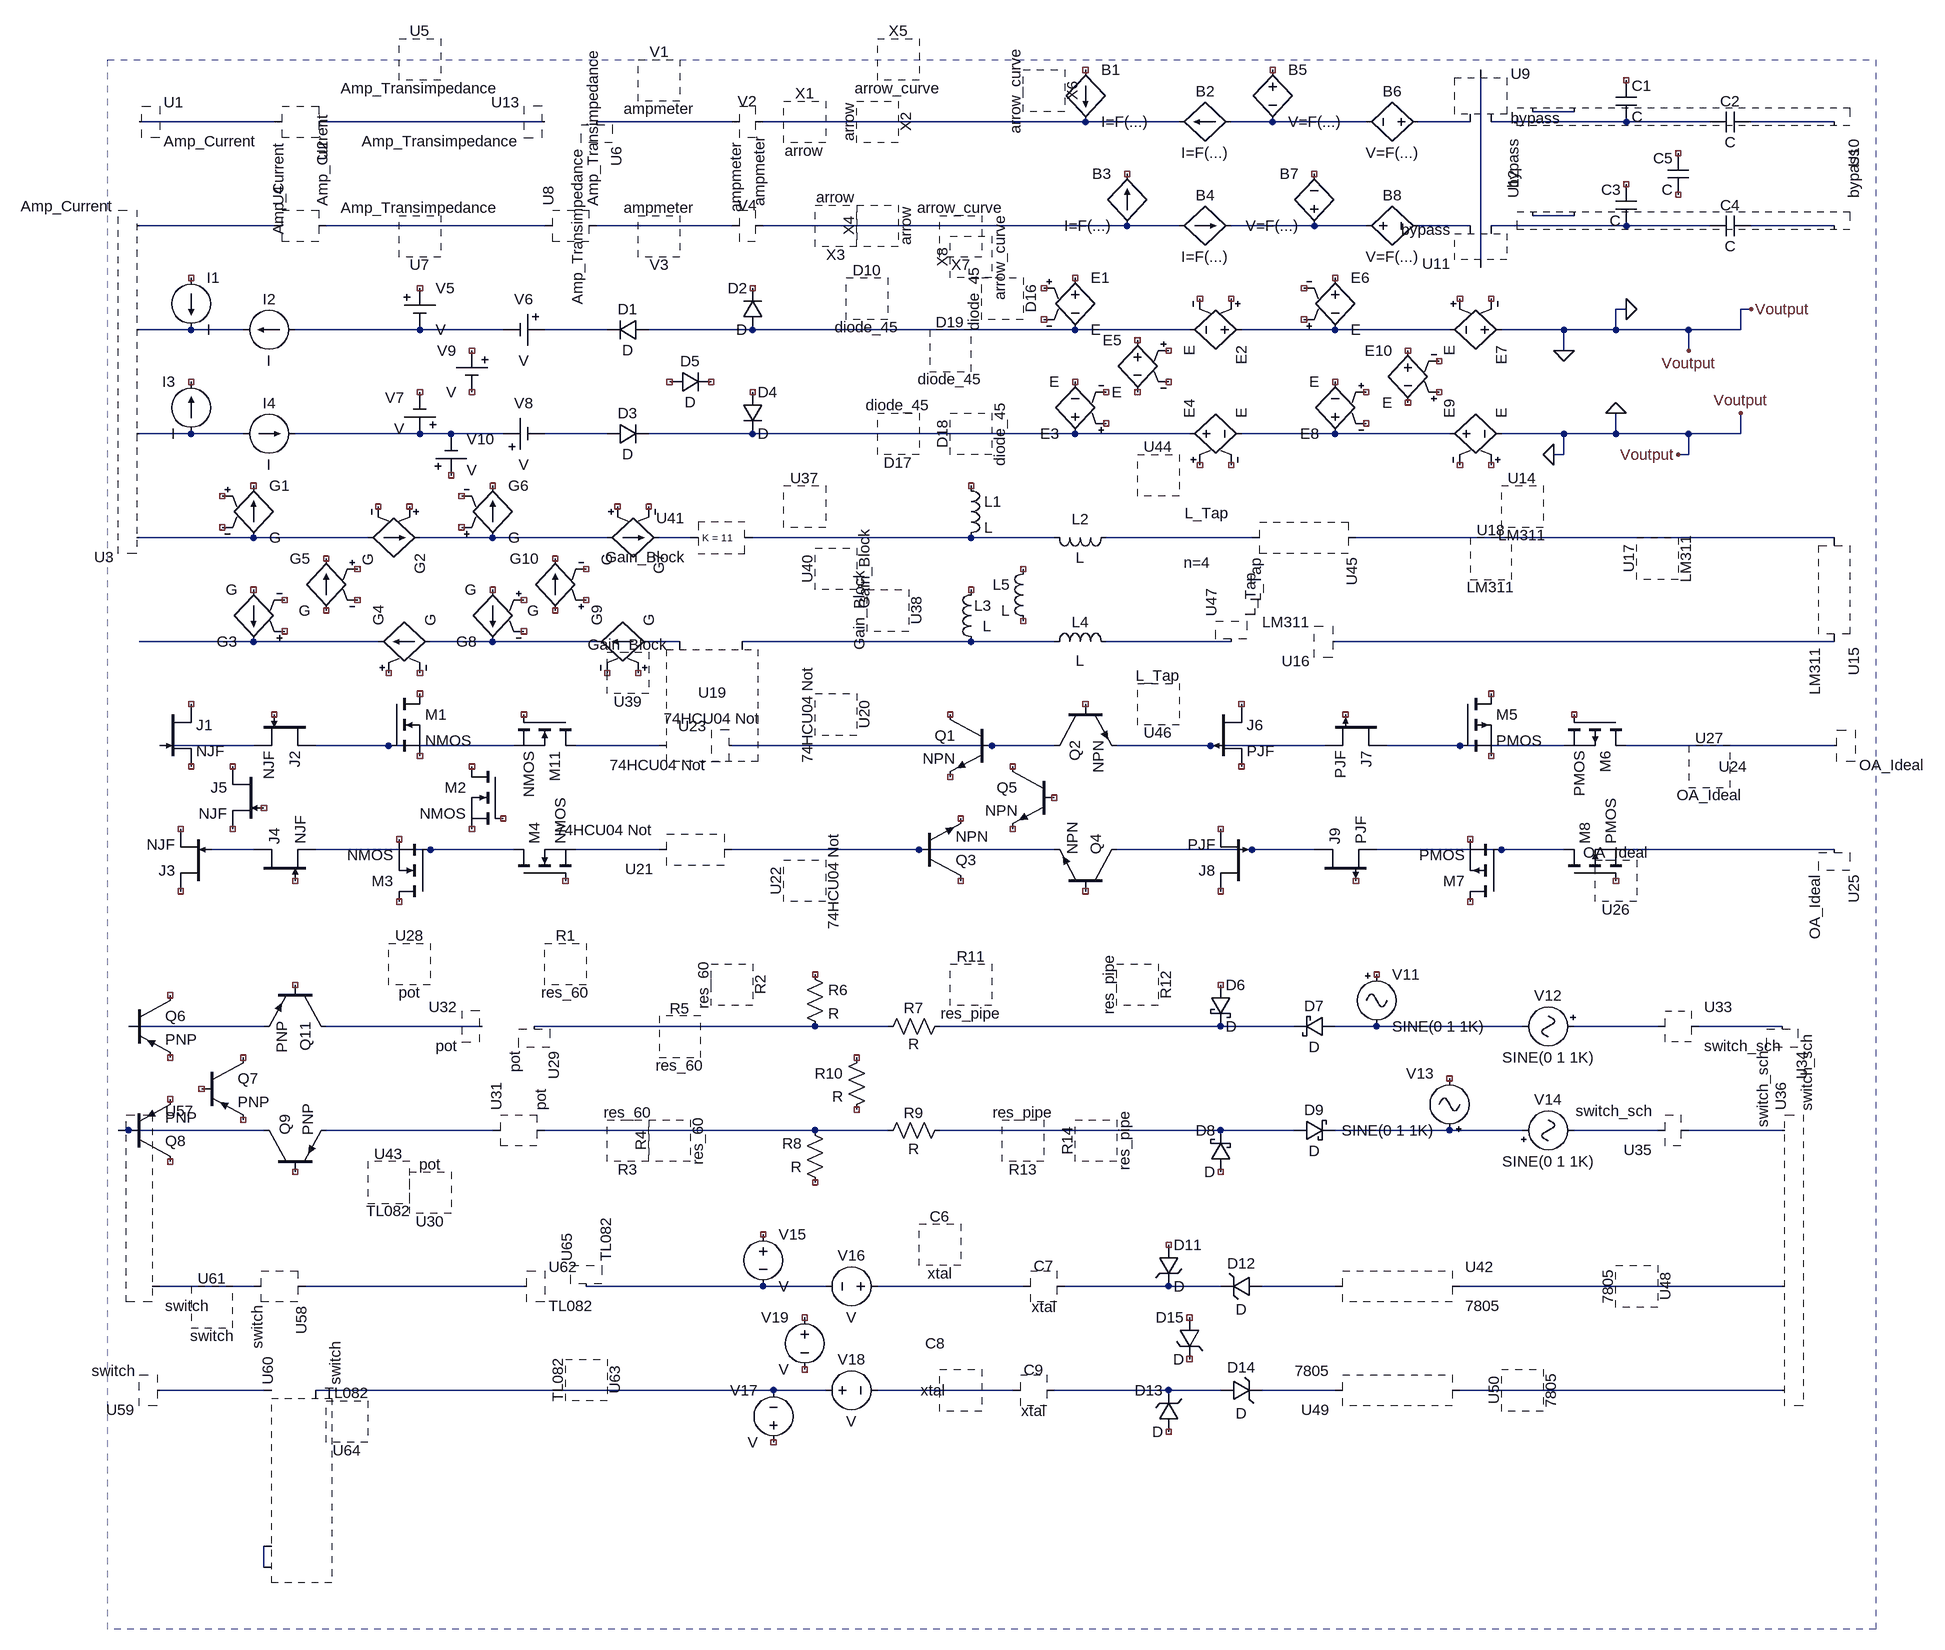
[diagram p0: schematic catalogo.asc]
catalogo.asc, the LTspice schematic file:
Version 4.1
SHEET 1 3172 3000
WIRE 2256 80 2192 80
WIRE 128 96 48 96
WIRE 256 96 128 96
WIRE 480 96 336 96
WIRE 672 96 480 96
WIRE 848 96 752 96
WIRE 960 96 848 96
WIRE 1504 96 1008 96
WIRE 1648 96 1504 96
WIRE 1792 96 1728 96
WIRE 1936 96 1792 96
WIRE 2096 96 2016 96
WIRE 2224 96 2128 96
WIRE 2336 96 2224 96
WIRE 2464 96 2336 96
WIRE 2656 96 2528 96
WIRE 2256 240 2192 240
WIRE 128 256 48 256
WIRE 256 256 128 256
WIRE 480 256 336 256
WIRE 672 256 480 256
WIRE 848 256 752 256
WIRE 960 256 848 256
WIRE 1568 256 1008 256
WIRE 1648 256 1568 256
WIRE 1856 256 1728 256
WIRE 1936 256 1856 256
WIRE 2096 256 2016 256
WIRE 2224 256 2128 256
WIRE 2336 256 2224 256
WIRE 2464 256 2336 256
WIRE 2656 256 2528 256
WIRE 2112 320 2112 16
WIRE 2336 384 2320 384
WIRE 2528 384 2512 384
WIRE 128 416 48 416
WIRE 208 416 128 416
WIRE 480 416 288 416
WIRE 608 416 480 416
WIRE 768 416 672 416
WIRE 992 416 832 416
WIRE 1168 416 992 416
WIRE 1376 416 1168 416
WIRE 1488 416 1376 416
WIRE 1664 416 1488 416
WIRE 1888 416 1744 416
WIRE 2064 416 1888 416
WIRE 2240 416 2144 416
WIRE 2320 416 2320 384
WIRE 2320 416 2240 416
WIRE 2432 416 2320 416
WIRE 2512 416 2512 384
WIRE 2512 416 2432 416
WIRE 2240 448 2240 416
WIRE 2432 448 2432 416
WIRE 128 576 48 576
WIRE 208 576 128 576
WIRE 480 576 288 576
WIRE 528 576 480 576
WIRE 608 576 528 576
WIRE 768 576 672 576
WIRE 992 576 832 576
WIRE 1168 576 992 576
WIRE 1376 576 1168 576
WIRE 1488 576 1376 576
WIRE 1664 576 1488 576
WIRE 1888 576 1744 576
WIRE 2064 576 1888 576
WIRE 2240 576 2144 576
WIRE 2320 576 2320 544
WIRE 2320 576 2240 576
WIRE 2432 576 2320 576
WIRE 2512 576 2512 544
WIRE 2512 576 2432 576
WIRE 2240 608 2240 576
WIRE 2240 608 2224 608
WIRE 2432 608 2432 576
WIRE 2432 608 2416 608
WIRE 224 736 48 736
WIRE 400 736 224 736
WIRE 592 736 480 736
WIRE 768 736 592 736
WIRE 896 736 848 736
WIRE 1328 736 992 736
WIRE 1456 736 1328 736
WIRE 1600 736 1536 736
WIRE 1760 736 1600 736
WIRE 2096 736 1920 736
WIRE 2656 736 2096 736
WIRE 224 896 48 896
WIRE 416 896 224 896
WIRE 592 896 496 896
WIRE 752 896 592 896
WIRE 880 896 832 896
WIRE 1328 896 976 896
WIRE 1456 896 1328 896
WIRE 1632 896 1536 896
WIRE 1728 896 1632 896
WIRE 1968 896 1888 896
WIRE 2656 896 1968 896
WIRE 224 1056 80 1056
WIRE 432 1056 320 1056
WIRE 624 1056 432 1056
WIRE 848 1056 720 1056
WIRE 1360 1056 960 1056
WIRE 1456 1056 1360 1056
WIRE 1696 1056 1552 1056
WIRE 1872 1056 1696 1056
WIRE 2080 1056 1968 1056
WIRE 2240 1056 2080 1056
WIRE 2512 1056 2336 1056
WIRE 2560 1056 2512 1056
WIRE 2656 1056 2560 1056
WIRE 224 1216 160 1216
WIRE 496 1216 320 1216
WIRE 624 1216 496 1216
WIRE 848 1216 720 1216
WIRE 1248 1216 960 1216
WIRE 1456 1216 1248 1216
WIRE 1760 1216 1552 1216
WIRE 1856 1216 1760 1216
WIRE 2144 1216 1952 1216
WIRE 2240 1216 2144 1216
WIRE 2400 1216 2336 1216
WIRE 2656 1216 2400 1216
WIRE 240 1488 32 1488
WIRE 480 1488 336 1488
WIRE 576 1488 480 1488
WIRE 768 1488 656 1488
WIRE 864 1488 768 1488
WIRE 1088 1488 864 1488
WIRE 1200 1488 1088 1488
WIRE 1344 1488 1280 1488
WIRE 1568 1488 1344 1488
WIRE 1712 1488 1568 1488
WIRE 1824 1488 1712 1488
WIRE 1952 1488 1888 1488
WIRE 2176 1488 1952 1488
WIRE 2384 1488 2256 1488
WIRE 2576 1488 2448 1488
WIRE 32 1648 16 1648
WIRE 240 1648 32 1648
WIRE 480 1648 336 1648
WIRE 592 1648 480 1648
WIRE 784 1648 672 1648
WIRE 880 1648 784 1648
WIRE 1088 1648 880 1648
WIRE 1200 1648 1088 1648
WIRE 1344 1648 1280 1648
WIRE 1584 1648 1344 1648
WIRE 1712 1648 1584 1648
WIRE 1824 1648 1712 1648
WIRE 2064 1648 1888 1648
WIRE 2176 1648 2064 1648
WIRE 2368 1648 2256 1648
WIRE 2384 1648 2368 1648
WIRE 2576 1648 2432 1648
WIRE 224 1888 80 1888
WIRE 560 1888 304 1888
WIRE 640 1888 560 1888
WIRE 1008 1888 736 1888
WIRE 1104 1888 1008 1888
WIRE 1296 1888 1184 1888
WIRE 1408 1888 1296 1888
WIRE 1632 1888 1472 1888
WIRE 1712 1888 1632 1888
WIRE 1888 1888 1776 1888
WIRE 2288 1888 2080 1888
WIRE 2576 1888 2288 1888
WIRE 240 2048 80 2048
WIRE 448 2048 320 2048
WIRE 1024 2048 448 2048
WIRE 1104 2048 1024 2048
WIRE 1296 2048 1184 2048
WIRE 1392 2048 1296 2048
WIRE 1632 2048 1456 2048
WIRE 1712 2048 1632 2048
WIRE 1888 2048 1776 2048
WIRE 2240 2048 2080 2048
WIRE 2576 2048 2240 2048
WIRE 240 2320 240 2288
FLAG 2240 448 0
FLAG 2336 384 0
FLAG 2224 608 0
FLAG 2320 544 0
FLAG 2432 448 Voutput
FLAG 2528 384 Voutput
FLAG 2416 608 Voutput
FLAG 2512 544 Voutput
SYMBOL TCLib\\Amp_Current 128 0 R0
SYMATTR InstName U1
SYMBOL TCLib\\Amp_Current 352 96 R90
SYMATTR InstName U2
SYMBOL TCLib\\Amp_Current 128 272 R180
SYMATTR InstName U3
SYMBOL TCLib\\Amp_Current 240 256 R270
SYMATTR InstName U4
SYMBOL TCLib\\Amp_Transimpedance 480 0 R0
SYMATTR InstName U5
SYMBOL TCLib\\Amp_Transimpedance 768 96 R90
SYMATTR InstName U6
SYMBOL TCLib\\Amp_Transimpedance 480 272 R180
SYMATTR InstName U7
SYMBOL TCLib\\Amp_Transimpedance 656 256 R270
SYMATTR InstName U8
SYMBOL TCLib\\Special\\ampmeter 848 32 R0
SYMATTR InstName V1
SYMBOL TCLib\\Special\\ampmeter 1024 96 R90
WINDOW 0 -16 40 VBottom 2
SYMATTR InstName V2
SYMBOL TCLib\\Special\\ampmeter 848 272 R180
SYMATTR InstName V3
SYMBOL TCLib\\Special\\ampmeter 944 256 R270
WINDOW 0 16 40 VTop 2
SYMATTR InstName V4
SYMBOL TCLib\\Special\\arrow 1072 96 R0
SYMATTR InstName X1
SYMBOL TCLib\\Special\\arrow 1184 96 R90
SYMATTR InstName X2
SYMBOL TCLib\\Special\\arrow 1120 256 R180
SYMATTR InstName X3
SYMBOL TCLib\\Special\\arrow 1184 256 R270
SYMATTR InstName X4
SYMBOL TCLib\\Special\\arrow_curve 1216 0 R0
SYMATTR InstName X5
SYMBOL TCLib\\Special\\arrow_curve 1440 48 R90
SYMATTR InstName X6
SYMBOL TCLib\\Special\\arrow_curve 1312 272 R180
SYMATTR InstName X7
SYMBOL TCLib\\Special\\arrow_curve 1328 304 R270
SYMATTR InstName X8
SYMBOL bi 1504 16 R0
SYMATTR InstName B1
SYMBOL bi 1728 96 R90
WINDOW 0 -32 40 VBottom 2
WINDOW 3 32 40 VTop 2
SYMATTR InstName B2
SYMBOL bi 1568 256 R180
WINDOW 0 24 80 Left 2
WINDOW 3 24 0 Left 2
SYMATTR InstName B3
SYMBOL bi 1648 256 R270
WINDOW 0 32 40 VTop 2
WINDOW 3 -32 40 VBottom 2
SYMATTR InstName B4
SYMBOL bv 1792 0 R0
SYMATTR InstName B5
SYMBOL bv 2032 96 R90
WINDOW 0 -32 56 VBottom 2
WINDOW 3 32 56 VTop 2
SYMATTR InstName B6
SYMBOL bv 1856 272 R180
WINDOW 0 24 96 Left 2
WINDOW 3 24 16 Left 2
SYMATTR InstName B7
SYMBOL bv 1920 256 R270
WINDOW 0 32 56 VTop 2
WINDOW 3 -32 56 VBottom 2
SYMATTR InstName B8
SYMBOL TCLib\\Special\\bypass 2096 96 R0
SYMATTR InstName U9
SYMBOL TCLib\\Special\\bypass 2224 64 R90
SYMATTR InstName U10
SYMBOL TCLib\\Special\\bypass 2128 256 R180
SYMATTR InstName U11
SYMBOL TCLib\\Special\\bypass 2224 256 R270
SYMATTR InstName U12
SYMBOL current 128 336 R0
SYMATTR InstName I1
SYMBOL current 288 416 R90
WINDOW 0 -32 40 VBottom 2
WINDOW 3 32 40 VTop 2
SYMATTR InstName I2
SYMBOL current 208 576 R270
WINDOW 0 32 40 VTop 2
WINDOW 3 -32 40 VBottom 2
SYMATTR InstName I4
SYMBOL current 128 576 R180
WINDOW 0 24 80 Left 2
WINDOW 3 24 0 Left 2
SYMATTR InstName I3
SYMBOL Misc\\cell 480 352 R0
SYMATTR InstName V5
SYMBOL Misc\\cell 672 416 R90
WINDOW 0 -32 32 VBottom 2
WINDOW 3 32 32 VTop 2
SYMATTR InstName V6
SYMBOL Misc\\cell 480 576 R180
WINDOW 0 24 56 Left 2
WINDOW 3 24 8 Left 2
SYMATTR InstName V7
SYMBOL Misc\\cell 608 576 R270
WINDOW 0 32 32 VTop 2
WINDOW 3 -32 32 VBottom 2
SYMATTR InstName V8
SYMBOL Misc\\cell 560 448 M0
SYMATTR InstName V9
SYMBOL TCLib\\Amp_Transimpedance 608 112 M0
SYMATTR InstName U13
SYMBOL diode 832 400 R90
WINDOW 0 0 32 VBottom 2
WINDOW 3 32 32 VTop 2
SYMATTR InstName D1
SYMBOL diode 1008 416 R180
WINDOW 0 24 64 Left 2
WINDOW 3 24 0 Left 2
SYMATTR InstName D2
SYMBOL diode 768 592 R270
WINDOW 0 32 32 VTop 2
WINDOW 3 0 32 VBottom 2
SYMATTR InstName D3
SYMBOL diode 976 512 R0
SYMATTR InstName D4
SYMBOL diode 864 480 M90
WINDOW 0 0 32 VBottom 2
WINDOW 3 32 32 VTop 2
SYMATTR InstName D5
SYMBOL e 1488 320 R0
SYMATTR InstName E1
SYMBOL e 1760 416 R90
SYMATTR InstName E2
SYMBOL e 1488 592 R180
SYMATTR InstName E3
SYMBOL e 1648 576 R270
SYMATTR InstName E4
SYMBOL e 1584 416 M0
SYMATTR InstName E5
SYMBOL e2 1888 320 R0
SYMATTR InstName E6
SYMBOL e2 2160 416 R90
SYMATTR InstName E7
SYMBOL e2 1888 592 R180
SYMATTR InstName E8
SYMBOL e2 2048 576 R270
SYMATTR InstName E9
SYMBOL e2 2000 432 M0
SYMATTR InstName E10
SYMBOL cap 2320 32 R0
SYMATTR InstName C1
SYMBOL cap 2528 80 R90
WINDOW 0 0 32 VBottom 2
WINDOW 3 32 32 VTop 2
SYMATTR InstName C2
SYMBOL cap 2352 256 R180
WINDOW 0 24 56 Left 2
WINDOW 3 24 8 Left 2
SYMATTR InstName C3
SYMBOL cap 2464 272 R270
WINDOW 0 32 32 VTop 2
WINDOW 3 0 32 VBottom 2
SYMATTR InstName C4
SYMBOL cap 2432 144 M0
SYMATTR InstName C5
SYMBOL g 224 640 R0
SYMATTR InstName G1
SYMBOL g 496 736 R90
SYMATTR InstName G2
SYMBOL g 224 912 R180
SYMATTR InstName G3
SYMBOL g 400 896 R270
SYMATTR InstName G4
SYMBOL g 336 752 M0
SYMATTR InstName G5
SYMBOL g2 592 640 R0
SYMATTR InstName G6
SYMBOL g2 864 736 R90
SYMATTR InstName G7
SYMBOL g2 592 912 R180
SYMATTR InstName G8
SYMBOL g2 736 896 R270
SYMATTR InstName G9
SYMBOL g2 688 752 M0
SYMATTR InstName G10
SYMBOL ind 1312 640 R0
SYMATTR InstName L1
SYMBOL ind 1552 720 R90
WINDOW 3 31 56 VTop 2
WINDOW 0 3 56 VBottom 2
SYMATTR InstName L2
SYMBOL ind 1344 912 R180
WINDOW 3 -2 40 Right 2
WINDOW 0 -2 72 Center 2
SYMATTR InstName L3
SYMBOL ind 1440 912 R270
WINDOW 3 3 56 VBottom 2
WINDOW 0 31 56 VTop 2
SYMATTR InstName L4
SYMBOL ind 1424 768 M0
SYMATTR InstName L5
SYMBOL TCLib\\LM311 2176 688 R0
SYMATTR InstName U14
SYMBOL TCLib\\LM311 2512 864 R90
SYMATTR InstName U15
SYMBOL TCLib\\LM311 1888 944 R180
SYMATTR InstName U16
SYMBOL TCLib\\LM311 2384 768 R270
SYMATTR InstName U17
SYMBOL TCLib\\LM311 2128 768 M0
SYMATTR InstName U18
SYMBOL TCLib\\Special\\74HCU04\ Not 896 992 R0
SYMATTR InstName U19
SYMBOL TCLib\\Special\\74HCU04\ Not 1120 1008 R90
SYMATTR InstName U20
SYMBOL TCLib\\Special\\74HCU04\ Not 912 1280 R180
SYMATTR InstName U21
SYMBOL TCLib\\Special\\74HCU04\ Not 1072 1264 R270
SYMATTR InstName U22
SYMBOL TCLib\\Special\\74HCU04\ Not 1024 1072 M0
SYMATTR InstName U23
SYMBOL npn 1360 1008 M0
SYMATTR InstName Q1
SYMBOL npn 1456 992 M90
SYMATTR InstName Q2
SYMBOL npn 1248 1264 M180
SYMATTR InstName Q3
SYMBOL npn 1552 1280 M270
SYMATTR InstName Q4
SYMBOL npn 1456 1088 M0
SYMATTR InstName Q5
SYMBOL TCLib\\TL082 432 1728 M0
SYMATTR InstName U43
SYMBOL TCLib\\Special\\L_Tap 1616 640 R0
WINDOW 3 41 58 Left 2
WINDOW 123 39 134 Left 2
SYMATTR Value2 n=4
SYMATTR InstName U44
SYMBOL TCLib\\Special\\L_Tap 1936 720 R90
SYMATTR InstName U45
SYMBOL TCLib\\Special\\L_Tap 1616 992 R180
SYMATTR InstName U46
SYMBOL TCLib\\Special\\L_Tap 1712 912 R270
SYMATTR InstName U47
SYMBOL res 1072 1392 R0
SYMATTR InstName R6
SYMBOL res 1296 1472 R90
WINDOW 0 3 56 VBottom 2
WINDOW 3 27 56 VTop 2
SYMATTR InstName R7
SYMBOL res 1104 1744 R180
WINDOW 0 36 76 Left 2
WINDOW 3 36 40 Left 2
SYMATTR InstName R8
SYMBOL res 1184 1664 R270
WINDOW 0 27 56 VTop 2
WINDOW 3 3 56 VBottom 2
SYMATTR InstName R9
SYMBOL res 1168 1520 M0
SYMATTR InstName R10
SYMBOL TCLib\\switch 80 1792 R0
SYMATTR InstName U57
SYMBOL TCLib\\switch 320 1888 R90
SYMATTR InstName U58
SYMBOL TCLib\\switch 80 2144 R180
SYMATTR InstName U59
SYMBOL TCLib\\switch 224 2048 R270
SYMATTR InstName U60
SYMBOL TCLib\\switch 160 1920 M0
SYMATTR InstName U61
SYMBOL TCLib\\TL082 640 1840 R0
SYMATTR InstName U62
SYMBOL TCLib\\TL082 736 2032 R90
SYMATTR InstName U63
SYMBOL TCLib\\TL082 368 2096 R180
SYMATTR InstName U64
SYMBOL TCLib\\TL082 656 1936 R270
SYMATTR InstName U65
SYMBOL voltage 1008 1792 R0
SYMATTR InstName V15
SYMBOL voltage 1200 1888 R90
WINDOW 0 -32 56 VBottom 2
WINDOW 3 32 56 VTop 2
SYMATTR InstName V16
SYMBOL voltage 1024 2144 R180
WINDOW 0 24 96 Left 2
WINDOW 3 24 16 Left 2
SYMATTR InstName V17
SYMBOL voltage 1088 2048 R270
WINDOW 0 32 56 VTop 2
WINDOW 3 -32 56 VBottom 2
SYMATTR InstName V18
SYMBOL voltage 1072 1920 M0
SYMATTR InstName V19
SYMBOL zener 1616 1824 R0
SYMATTR InstName D11
SYMBOL zener 1776 1872 R90
WINDOW 0 -4 32 VBottom 2
WINDOW 3 36 32 VTop 2
SYMATTR InstName D12
SYMBOL zener 1648 2112 R180
WINDOW 0 24 64 Left 2
WINDOW 3 24 0 Left 2
SYMATTR InstName D13
SYMBOL zener 1712 2064 R270
WINDOW 0 36 32 VTop 2
WINDOW 3 -4 32 VBottom 2
SYMATTR InstName D14
SYMBOL zener 1680 1936 M0
SYMATTR InstName D15
SYMBOL njf 80 992 R0
SYMATTR InstName J1
SYMBOL njf 320 1008 R90
SYMATTR InstName J2
SYMBOL njf 160 1280 R180
SYMATTR InstName J3
SYMBOL njf 224 1264 R270
SYMATTR InstName J4
SYMBOL nmos 432 976 R0
SYMATTR InstName M1
SYMBOL nmos 496 1296 R180
SYMATTR InstName M3
SYMBOL nmos 624 1264 R270
SYMATTR InstName M4
SYMBOL pjf 1696 992 R0
SYMATTR InstName J6
SYMBOL pjf 1968 1008 R90
SYMATTR InstName J7
SYMBOL pjf 1760 1280 R180
SYMATTR InstName J8
SYMBOL pjf 1856 1264 R270
SYMATTR InstName J9
SYMBOL pmos 2080 976 R0
SYMATTR InstName M5
SYMBOL pmos 2336 1008 R90
SYMATTR InstName M6
SYMBOL pmos 2144 1296 R180
SYMATTR InstName M7
SYMBOL pmos 2240 1264 R270
SYMATTR InstName M8
SYMBOL TCLib\\OA_Ideal 2592 1008 R0
WINDOW 0 -114 80 Left 2
SYMATTR InstName U24
SYMBOL TCLib\\OA_Ideal 2608 1136 R90
SYMATTR InstName U25
SYMBOL TCLib\\OA_Ideal 2320 1264 R180
SYMATTR InstName U26
SYMBOL TCLib\\OA_Ideal 2464 1088 M0
SYMATTR InstName U27
SYMBOL pnp 32 1440 R0
SYMATTR InstName Q6
SYMBOL pnp 336 1424 R90
SYMATTR InstName Q11
SYMBOL pnp 32 1696 M180
SYMATTR InstName Q8
SYMBOL pnp 240 1712 R270
SYMATTR InstName Q9
SYMBOL pnp 144 1536 R0
SYMATTR InstName Q7
SYMBOL TCLib\\pot 464 1392 R0
SYMATTR InstName U28
SYMBOL TCLib\\pot 672 1472 R90
SYMATTR InstName U29
SYMBOL TCLib\\pot 496 1744 R180
SYMATTR InstName U30
SYMBOL TCLib\\pot 576 1664 R270
SYMATTR InstName U31
SYMBOL TCLib\\pot 544 1520 M0
SYMATTR InstName U32
SYMBOL schottky 1696 1424 R0
SYMATTR InstName D6
SYMBOL schottky 1888 1472 R90
WINDOW 0 0 32 VBottom 2
WINDOW 3 32 32 VTop 2
SYMATTR InstName D7
SYMBOL schottky 1728 1712 R180
WINDOW 0 24 64 Left 2
WINDOW 3 24 0 Left 2
SYMATTR InstName D8
SYMBOL schottky 1824 1664 R270
WINDOW 0 32 32 VTop 2
WINDOW 3 0 32 VBottom 2
SYMATTR InstName D9
SYMBOL TCLib\\Special\\switch_sch 2368 1472 R0
SYMATTR InstName U33
SYMBOL TCLib\\Special\\switch_sch 2592 1408 R90
SYMATTR InstName U34
SYMBOL TCLib\\Special\\switch_sch 2448 1664 R180
SYMATTR InstName U35
SYMBOL TCLib\\Special\\switch_sch 2560 1728 R270
SYMATTR InstName U36
SYMBOL TCLib\\Special\\res_60 704 1392 R0
SYMATTR InstName R1
SYMBOL TCLib\\Special\\res_60 960 1424 R90
SYMATTR InstName R2
SYMBOL TCLib\\Special\\res_60 800 1664 R180
SYMATTR InstName R3
SYMBOL TCLib\\Special\\res_60 864 1664 R270
SYMATTR InstName R4
SYMBOL Misc\\cell 528 640 M180
WINDOW 0 24 56 Left 2
WINDOW 3 24 8 Left 2
SYMATTR InstName V10
SYMBOL njf 240 1088 M0
SYMATTR InstName J5
SYMBOL nmos 608 1088 M0
SYMATTR InstName M2
SYMBOL nmos 720 1008 R90
SYMATTR InstName M11
SYMBOL TCLib\\Special\\res_60 880 1504 M0
SYMATTR InstName R5
SYMBOL TCLib\\Special\\diode_45 1168 368 R0
SYMATTR InstName D10
SYMBOL TCLib\\Special\\diode_45 1376 368 R90
SYMATTR InstName D16
SYMBOL TCLib\\Special\\diode_45 1216 576 R180
SYMATTR InstName D17
SYMBOL TCLib\\Special\\diode_45 1328 576 R270
SYMATTR InstName D18
SYMBOL TCLib\\Special\\diode_45 1296 448 M0
SYMATTR InstName D19
SYMBOL TCLib\\Special\\Gain_Block 1072 688 R0
WINDOW 3 -158 48 Left 1
SYMATTR Value K = 11
SYMATTR InstName U37
SYMBOL TCLib\\Special\\Gain_Block 1200 848 R90
SYMATTR InstName U38
SYMBOL TCLib\\Special\\Gain_Block 800 944 R180
SYMATTR InstName U39
SYMBOL TCLib\\Special\\Gain_Block 1120 784 R270
SYMATTR InstName U40
SYMBOL TCLib\\Special\\Gain_Block 912 768 M0
SYMATTR InstName U41
SYMBOL TCLib\\Special\\res_pipe 1328 1424 R0
SYMATTR InstName R11
SYMBOL TCLib\\Special\\res_pipe 1584 1424 R90
SYMATTR InstName R12
SYMBOL TCLib\\Special\\res_pipe 1408 1664 R180
SYMATTR InstName R13
SYMBOL TCLib\\Special\\res_pipe 1520 1664 R270
SYMATTR InstName R14
SYMBOL Misc\\signal 1952 1392 R0
SYMATTR InstName V11
SYMBOL Misc\\signal 2272 1488 R90
WINDOW 0 -32 56 VBottom 2
WINDOW 3 32 56 VTop 2
SYMATTR InstName V12
SYMBOL Misc\\signal 2064 1664 R180
WINDOW 0 24 104 Left 2
WINDOW 3 24 16 Left 2
SYMATTR InstName V13
SYMBOL Misc\\signal 2160 1648 R270
WINDOW 0 32 56 VTop 2
WINDOW 3 -32 56 VBottom 2
SYMATTR InstName V14
SYMBOL Misc\\xtal 1280 1824 R0
SYMATTR InstName C6
SYMBOL Misc\\xtal 1472 1872 R90
WINDOW 0 0 32 VBottom 2
WINDOW 3 32 32 VTop 2
SYMATTR InstName C7
SYMBOL Misc\\xtal 1312 2048 R180
WINDOW 0 24 72 Left 2
WINDOW 3 24 0 Left 2
SYMATTR InstName C8
SYMBOL Misc\\xtal 1392 2064 R270
WINDOW 0 32 32 VTop 2
WINDOW 3 0 32 VBottom 2
SYMATTR InstName C9
SYMBOL TCLib\\Regulators\\7805 1984 1888 R0
SYMATTR InstName U42
SYMBOL TCLib\\Regulators\\7805 2352 1888 R90
SYMATTR InstName U48
SYMBOL TCLib\\Regulators\\7805 1984 2048 R180
SYMATTR InstName U49
SYMBOL TCLib\\Regulators\\7805 2176 2048 R270
SYMATTR InstName U50
RECTANGLE Normal 2720 2416 0 0 2

The netlist it stands for:
* catalogo.asc
* U1: Amp_Current (symbol TCLib\Amp_Current not available, pin order unknown); nets seen at it: N002
* U2: Amp_Current (symbol TCLib\Amp_Current not available, pin order unknown); nets seen at it: N002, N003
* U3: Amp_Current (symbol TCLib\Amp_Current not available, pin order unknown); nets seen at it: N011, N020, N025, N030
* U4: Amp_Current (symbol TCLib\Amp_Current not available, pin order unknown); nets seen at it: N011, N012
* U5: Amp_Transimpedance (symbol TCLib\Amp_Transimpedance not available, pin order unknown); nets seen at it: 
* U6: Amp_Transimpedance (symbol TCLib\Amp_Transimpedance not available, pin order unknown); nets seen at it: N004
* U7: Amp_Transimpedance (symbol TCLib\Amp_Transimpedance not available, pin order unknown); nets seen at it: 
* U8: Amp_Transimpedance (symbol TCLib\Amp_Transimpedance not available, pin order unknown); nets seen at it: N012, N013
* V1: ampmeter (symbol TCLib\Special\ampmeter not available, pin order unknown); nets seen at it: 
* V2: ampmeter (symbol TCLib\Special\ampmeter not available, pin order unknown); nets seen at it: N004, N005
* V3: ampmeter (symbol TCLib\Special\ampmeter not available, pin order unknown); nets seen at it: 
* V4: ampmeter (symbol TCLib\Special\ampmeter not available, pin order unknown); nets seen at it: N013, N014
* X1: arrow (symbol TCLib\Special\arrow not available, pin order unknown); nets seen at it: 
* X2: arrow (symbol TCLib\Special\arrow not available, pin order unknown); nets seen at it: 
* X3: arrow (symbol TCLib\Special\arrow not available, pin order unknown); nets seen at it: 
* X4: arrow (symbol TCLib\Special\arrow not available, pin order unknown); nets seen at it: 
* X5: arrow_curve (symbol TCLib\Special\arrow_curve not available, pin order unknown); nets seen at it: 
* X6: arrow_curve (symbol TCLib\Special\arrow_curve not available, pin order unknown); nets seen at it: 
* X7: arrow_curve (symbol TCLib\Special\arrow_curve not available, pin order unknown); nets seen at it: 
* X8: arrow_curve (symbol TCLib\Special\arrow_curve not available, pin order unknown); nets seen at it: 
B1 NC_01 N005 I=F(...)
B2 N006 N005 I=F(...)
B3 N014 NC_02 I=F(...)
B4 N014 N015 I=F(...)
B5 NC_03 N006 V=F(...)
B6 N007 N006 V=F(...)
B7 N015 NC_04 V=F(...)
B8 N015 N016 V=F(...)
* U9: bypass (symbol TCLib\Special\bypass not available, pin order unknown); nets seen at it: N007, N008, N019
* U10: bypass (symbol TCLib\Special\bypass not available, pin order unknown); nets seen at it: N001, N009
* U11: bypass (symbol TCLib\Special\bypass not available, pin order unknown); nets seen at it: N016, N017, N019
* U12: bypass (symbol TCLib\Special\bypass not available, pin order unknown); nets seen at it: N010, N018
I1 NC_05 N020 I
I2 N021 N020 I
I4 N025 N026 I
I3 N025 NC_06 I
V5 NC_07 N021 V
V6 N022 N021 V
V7 N026 NC_08 V
V8 N026 N027 V
V9 NC_09 NC_10 V
* U13: Amp_Transimpedance (symbol TCLib\Amp_Transimpedance not available, pin order unknown); nets seen at it: N003
D1 N023 N022 D
D2 N023 NC_11 D
D3 N027 N028 D
D4 NC_12 N028 D
D5 NC_13 NC_14 D
E1 NC_15 N023 NC_16 NC_17 E
E2 N024 N023 NC_18 NC_19 E
E3 N028 NC_20 NC_21 NC_22 E
E4 N028 N029 NC_23 NC_24 E
E5 NC_25 NC_26 NC_27 NC_28 E
E6 NC_29 N024 NC_30 NC_31 E
E7 0 N024 NC_32 NC_33 E
E8 N029 NC_34 NC_35 NC_36 E
E9 N029 0 NC_37 NC_38 E
E10 NC_39 NC_40 NC_41 NC_42 E
C1 NC_43 N008 C
C2 N009 N008 C
C3 N017 NC_44 C
C4 N017 N018 C
C5 NC_45 NC_46 C
G1 N030 NC_47 NC_48 NC_49 G
G2 N030 N031 NC_50 NC_51 G
G3 NC_52 N036 NC_53 NC_54 G
G4 N037 N036 NC_55 NC_56 G
G5 NC_57 NC_58 NC_59 NC_60 G
G6 N031 NC_61 NC_62 NC_63 G
G7 N031 N032 NC_64 NC_65 G
G8 NC_66 N037 NC_67 NC_68 G
G9 N038 N037 NC_69 NC_70 G
G10 NC_71 NC_72 NC_73 NC_74 G
L1 NC_75 N033 L
L2 N034 N033 L
L3 N039 NC_76 L
L4 N039 N040 L
L5 NC_77 NC_78 L
* U14: LM311 (symbol TCLib\LM311 not available, pin order unknown); nets seen at it: 
* U15: LM311 (symbol TCLib\LM311 not available, pin order unknown); nets seen at it: N035, N041
* U16: LM311 (symbol TCLib\LM311 not available, pin order unknown); nets seen at it: N041
* U17: LM311 (symbol TCLib\LM311 not available, pin order unknown); nets seen at it: 
* U18: LM311 (symbol TCLib\LM311 not available, pin order unknown); nets seen at it: 
* U19: 74HCU04 Not (symbol TCLib\Special\74HCU04 Not not available, pin order unknown); nets seen at it: N038, N039, N044
* U20: 74HCU04 Not (symbol TCLib\Special\74HCU04 Not not available, pin order unknown); nets seen at it: 
* U21: 74HCU04 Not (symbol TCLib\Special\74HCU04 Not not available, pin order unknown); nets seen at it: N051, N052
* U22: 74HCU04 Not (symbol TCLib\Special\74HCU04 Not not available, pin order unknown); nets seen at it: 
* U23: 74HCU04 Not (symbol TCLib\Special\74HCU04 Not not available, pin order unknown); nets seen at it: N045
Q1 NC_79 N045 NC_80 0 NPN
Q2 N045 NC_81 N046 0 NPN
Q3 NC_82 N052 NC_83 0 NPN
Q4 N053 NC_84 N052 0 NPN
Q5 NC_85 NC_86 NC_87 0 NPN
* U43: TL082 (symbol TCLib\TL082 not available, pin order unknown); nets seen at it: 
* U44: n=4 (symbol TCLib\Special\L_Tap not available, pin order unknown); nets seen at it: 
* U45: L_Tap (symbol TCLib\Special\L_Tap not available, pin order unknown); nets seen at it: N034, N035
* U46: L_Tap (symbol TCLib\Special\L_Tap not available, pin order unknown); nets seen at it: 
* U47: L_Tap (symbol TCLib\Special\L_Tap not available, pin order unknown); nets seen at it: N040
R6 NC_88 N058 R
R7 N059 N058 R
R8 NC_89 N065 R
R9 N065 N066 R
R10 NC_90 NC_91 R
* U57: switch (symbol TCLib\switch not available, pin order unknown); nets seen at it: N063, N070
* U58: switch (symbol TCLib\switch not available, pin order unknown); nets seen at it: N070, N071
* U59: switch (symbol TCLib\switch not available, pin order unknown); nets seen at it: N077
* U60: switch (symbol TCLib\switch not available, pin order unknown); nets seen at it: N077, N078, N083
* U61: switch (symbol TCLib\switch not available, pin order unknown); nets seen at it: 
* U62: TL082 (symbol TCLib\TL082 not available, pin order unknown); nets seen at it: N071
* U63: TL082 (symbol TCLib\TL082 not available, pin order unknown); nets seen at it: 
* U64: TL082 (symbol TCLib\TL082 not available, pin order unknown); nets seen at it: 
* U65: TL082 (symbol TCLib\TL082 not available, pin order unknown); nets seen at it: N072
V15 NC_92 N072 V
V16 N073 N072 V
V17 NC_93 N078 V
V18 N078 N079 V
V19 NC_94 NC_95 V
D11 NC_96 N074 D
D12 N075 N074 D
D13 NC_97 N080 D
D14 N080 N081 D
D15 NC_98 NC_99 D
J1 NC_100 N042 NC_101 NJF
J2 N043 NC_102 N042 NJF
J3 NC_103 N049 NC_104 NJF
J4 N049 NC_105 N050 NJF
M1 NC_106 N043 NC_107 NC_107 NMOS
M3 NC_108 N050 NC_109 NC_109 NMOS
M4 N050 NC_110 N051 N051 NMOS
J6 NC_111 N046 NC_112 PJF
J7 N047 NC_113 N046 PJF
J8 NC_114 N053 NC_115 PJF
J9 N053 NC_116 N054 PJF
M5 NC_117 N047 NC_118 NC_118 PMOS
M6 N048 NC_119 N047 N047 PMOS
M7 NC_120 N054 NC_121 NC_121 PMOS
M8 N054 NC_122 N055 N055 PMOS
* U24: OA_Ideal (symbol TCLib\OA_Ideal not available, pin order unknown); nets seen at it: N048
* U25: OA_Ideal (symbol TCLib\OA_Ideal not available, pin order unknown); nets seen at it: N055
* U26: OA_Ideal (symbol TCLib\OA_Ideal not available, pin order unknown); nets seen at it: 
* U27: OA_Ideal (symbol TCLib\OA_Ideal not available, pin order unknown); nets seen at it: 
Q6 NC_123 N056 NC_124 0 PNP
Q11 N057 NC_125 N056 0 PNP
Q8 NC_126 N063 NC_127 0 PNP
Q9 N063 NC_128 N064 0 PNP
Q7 NC_129 NC_130 NC_131 0 PNP
* U28: pot (symbol TCLib\pot not available, pin order unknown); nets seen at it: 
* U29: pot (symbol TCLib\pot not available, pin order unknown); nets seen at it: N058
* U30: pot (symbol TCLib\pot not available, pin order unknown); nets seen at it: 
* U31: pot (symbol TCLib\pot not available, pin order unknown); nets seen at it: N064, N065
* U32: pot (symbol TCLib\pot not available, pin order unknown); nets seen at it: N057
D6 NC_132 N059 D
D7 N060 N059 D
D8 NC_133 N066 D
D9 N066 N067 D
* U33: switch_sch (symbol TCLib\Special\switch_sch not available, pin order unknown); nets seen at it: N061, N062
* U34: switch_sch (symbol TCLib\Special\switch_sch not available, pin order unknown); nets seen at it: N062
* U35: switch_sch (symbol TCLib\Special\switch_sch not available, pin order unknown); nets seen at it: N068, N069
* U36: switch_sch (symbol TCLib\Special\switch_sch not available, pin order unknown); nets seen at it: N069, N076, N082
* R1: res_60 (symbol TCLib\Special\res_60 not available, pin order unknown); nets seen at it: 
* R2: res_60 (symbol TCLib\Special\res_60 not available, pin order unknown); nets seen at it: 
* R3: res_60 (symbol TCLib\Special\res_60 not available, pin order unknown); nets seen at it: 
* R4: res_60 (symbol TCLib\Special\res_60 not available, pin order unknown); nets seen at it: 
V10 NC_134 N026 V
J5 NC_135 NC_136 NC_137 NJF
M2 NC_138 NC_139 NC_140 NC_140 NMOS
M11 N044 NC_141 N043 N043 NMOS
* R5: res_60 (symbol TCLib\Special\res_60 not available, pin order unknown); nets seen at it: 
* D10: diode_45 (symbol TCLib\Special\diode_45 not available, pin order unknown); nets seen at it: 
* D16: diode_45 (symbol TCLib\Special\diode_45 not available, pin order unknown); nets seen at it: 
* D17: diode_45 (symbol TCLib\Special\diode_45 not available, pin order unknown); nets seen at it: 
* D18: diode_45 (symbol TCLib\Special\diode_45 not available, pin order unknown); nets seen at it: 
* D19: diode_45 (symbol TCLib\Special\diode_45 not available, pin order unknown); nets seen at it: 
* U37: K = 11 (symbol TCLib\Special\Gain_Block not available, pin order unknown); nets seen at it: 
* U38: Gain_Block (symbol TCLib\Special\Gain_Block not available, pin order unknown); nets seen at it: 
* U39: Gain_Block (symbol TCLib\Special\Gain_Block not available, pin order unknown); nets seen at it: 
* U40: Gain_Block (symbol TCLib\Special\Gain_Block not available, pin order unknown); nets seen at it: 
* U41: Gain_Block (symbol TCLib\Special\Gain_Block not available, pin order unknown); nets seen at it: N032, N033
* R11: res_pipe (symbol TCLib\Special\res_pipe not available, pin order unknown); nets seen at it: 
* R12: res_pipe (symbol TCLib\Special\res_pipe not available, pin order unknown); nets seen at it: 
* R13: res_pipe (symbol TCLib\Special\res_pipe not available, pin order unknown); nets seen at it: 
* R14: res_pipe (symbol TCLib\Special\res_pipe not available, pin order unknown); nets seen at it: 
V11 NC_142 N060 SINE(0 1 1K)
V12 N061 N060 SINE(0 1 1K)
V13 N067 NC_143 SINE(0 1 1K)
V14 N067 N068 SINE(0 1 1K)
* C6: xtal (symbol Misc\xtal not available, pin order unknown); nets seen at it: 
* C7: xtal (symbol Misc\xtal not available, pin order unknown); nets seen at it: N073, N074
* C8: xtal (symbol Misc\xtal not available, pin order unknown); nets seen at it: 
* C9: xtal (symbol Misc\xtal not available, pin order unknown); nets seen at it: N079, N080
* U42: 7805 (symbol TCLib\Regulators\7805 not available, pin order unknown); nets seen at it: N075, N076
* U48: 7805 (symbol TCLib\Regulators\7805 not available, pin order unknown); nets seen at it: 
* U49: 7805 (symbol TCLib\Regulators\7805 not available, pin order unknown); nets seen at it: N081, N082
* U50: 7805 (symbol TCLib\Regulators\7805 not available, pin order unknown); nets seen at it: 
.model D D
.lib standard.dio
.model NPN NPN
.model PNP PNP
.lib standard.bjt
.model NJF NJF
.model PJF PJF
.lib standard.jft
.model NMOS NMOS
.model PMOS PMOS
.lib standard.mos
.backanno
.end